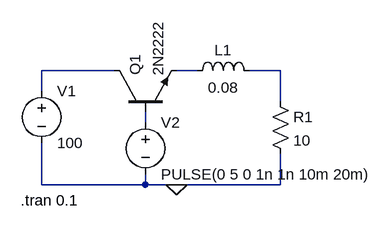
[diagram p0: schematic step_down_chopper.asc]
step_down_chopper.asc, the LTspice schematic file:
Version 4
SHEET 1 880 680
WIRE 112 64 0 64
WIRE 240 64 208 64
WIRE 368 64 320 64
WIRE 0 96 0 64
WIRE 368 112 368 64
WIRE 160 144 160 128
WIRE 0 240 0 176
WIRE 160 240 160 224
WIRE 160 240 0 240
WIRE 208 240 160 240
WIRE 368 240 368 192
WIRE 368 240 208 240
FLAG 208 240 0
SYMBOL voltage 0 80 R0
WINDOW 123 0 0 Left 0
WINDOW 39 0 0 Left 0
SYMATTR InstName V1
SYMATTR Value 100
SYMBOL ind 224 80 R270
WINDOW 0 32 56 VTop 2
WINDOW 3 5 56 VBottom 2
SYMATTR InstName L1
SYMATTR Value 0.08
SYMBOL res 352 96 R0
SYMATTR InstName R1
SYMATTR Value 10
SYMBOL npn 112 128 R270
SYMATTR InstName Q1
SYMATTR Value 2N2222
SYMBOL voltage 160 128 R0
WINDOW 123 0 0 Left 0
WINDOW 39 0 0 Left 0
SYMATTR InstName V2
SYMATTR Value PULSE(0 5 0 1n 1n 10m 20m)
TEXT -32 264 Left 2 !.tran 0.1

The netlist it stands for:
* step_down_chopper.asc
V1 N001 0 100
L1 N002 N003 0.08
R1 N003 0 10
Q1 N001 N004 N002 0 2N2222
V2 N004 0 PULSE(0 5 0 1n 1n 10m 20m)
.model NPN NPN
.model PNP PNP
.lib standard.bjt
.tran 0.1
.backanno
.end